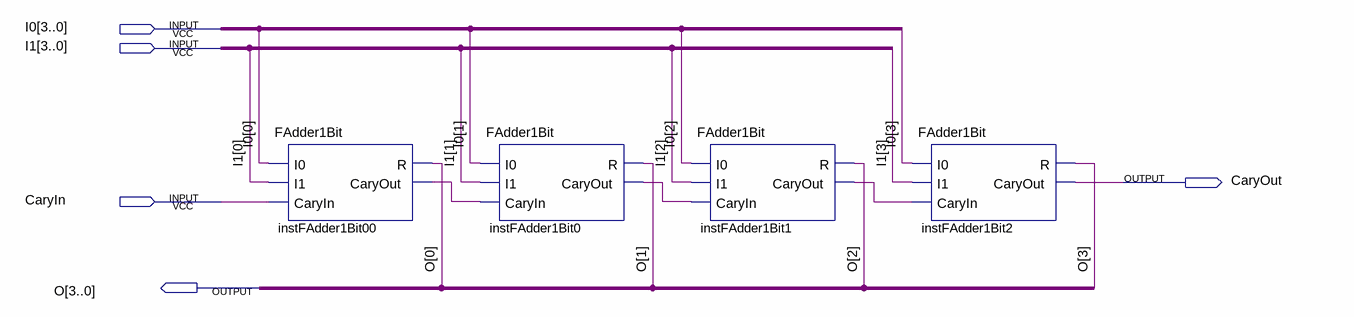
[diagram p0: schematic sheet]
// Quartus schematic Adder4Bit.bdf as structural Verilog: 4 symbols, 5 pins
module Adder4Bit (
  input  [3:0] I0,
  input  [3:0] I1,
  input  CaryIn,
  output CaryOut,
  output [3:0] O
);

  wire instFAdder1Bit0_caryout, instFAdder1Bit00_caryout, instFAdder1Bit1_caryout;

  FAdder1Bit instFAdder1Bit00 (.I0(I0[0]), .I1(I1[0]), .CaryIn(CaryIn), .R(O[0]), .CaryOut(instFAdder1Bit00_caryout));
  FAdder1Bit instFAdder1Bit0 (
    .I0(I0[1]), .I1(I1[1]), .CaryIn(instFAdder1Bit00_caryout), .R(O[1]), .CaryOut(instFAdder1Bit0_caryout));
  FAdder1Bit instFAdder1Bit1 (
    .I0(I0[2]), .I1(I1[2]), .CaryIn(instFAdder1Bit0_caryout), .R(O[2]), .CaryOut(instFAdder1Bit1_caryout));
  FAdder1Bit instFAdder1Bit2 (.I0(I0[3]), .I1(I1[3]), .CaryIn(instFAdder1Bit1_caryout), .R(O[3]), .CaryOut(CaryOut));
endmodule
